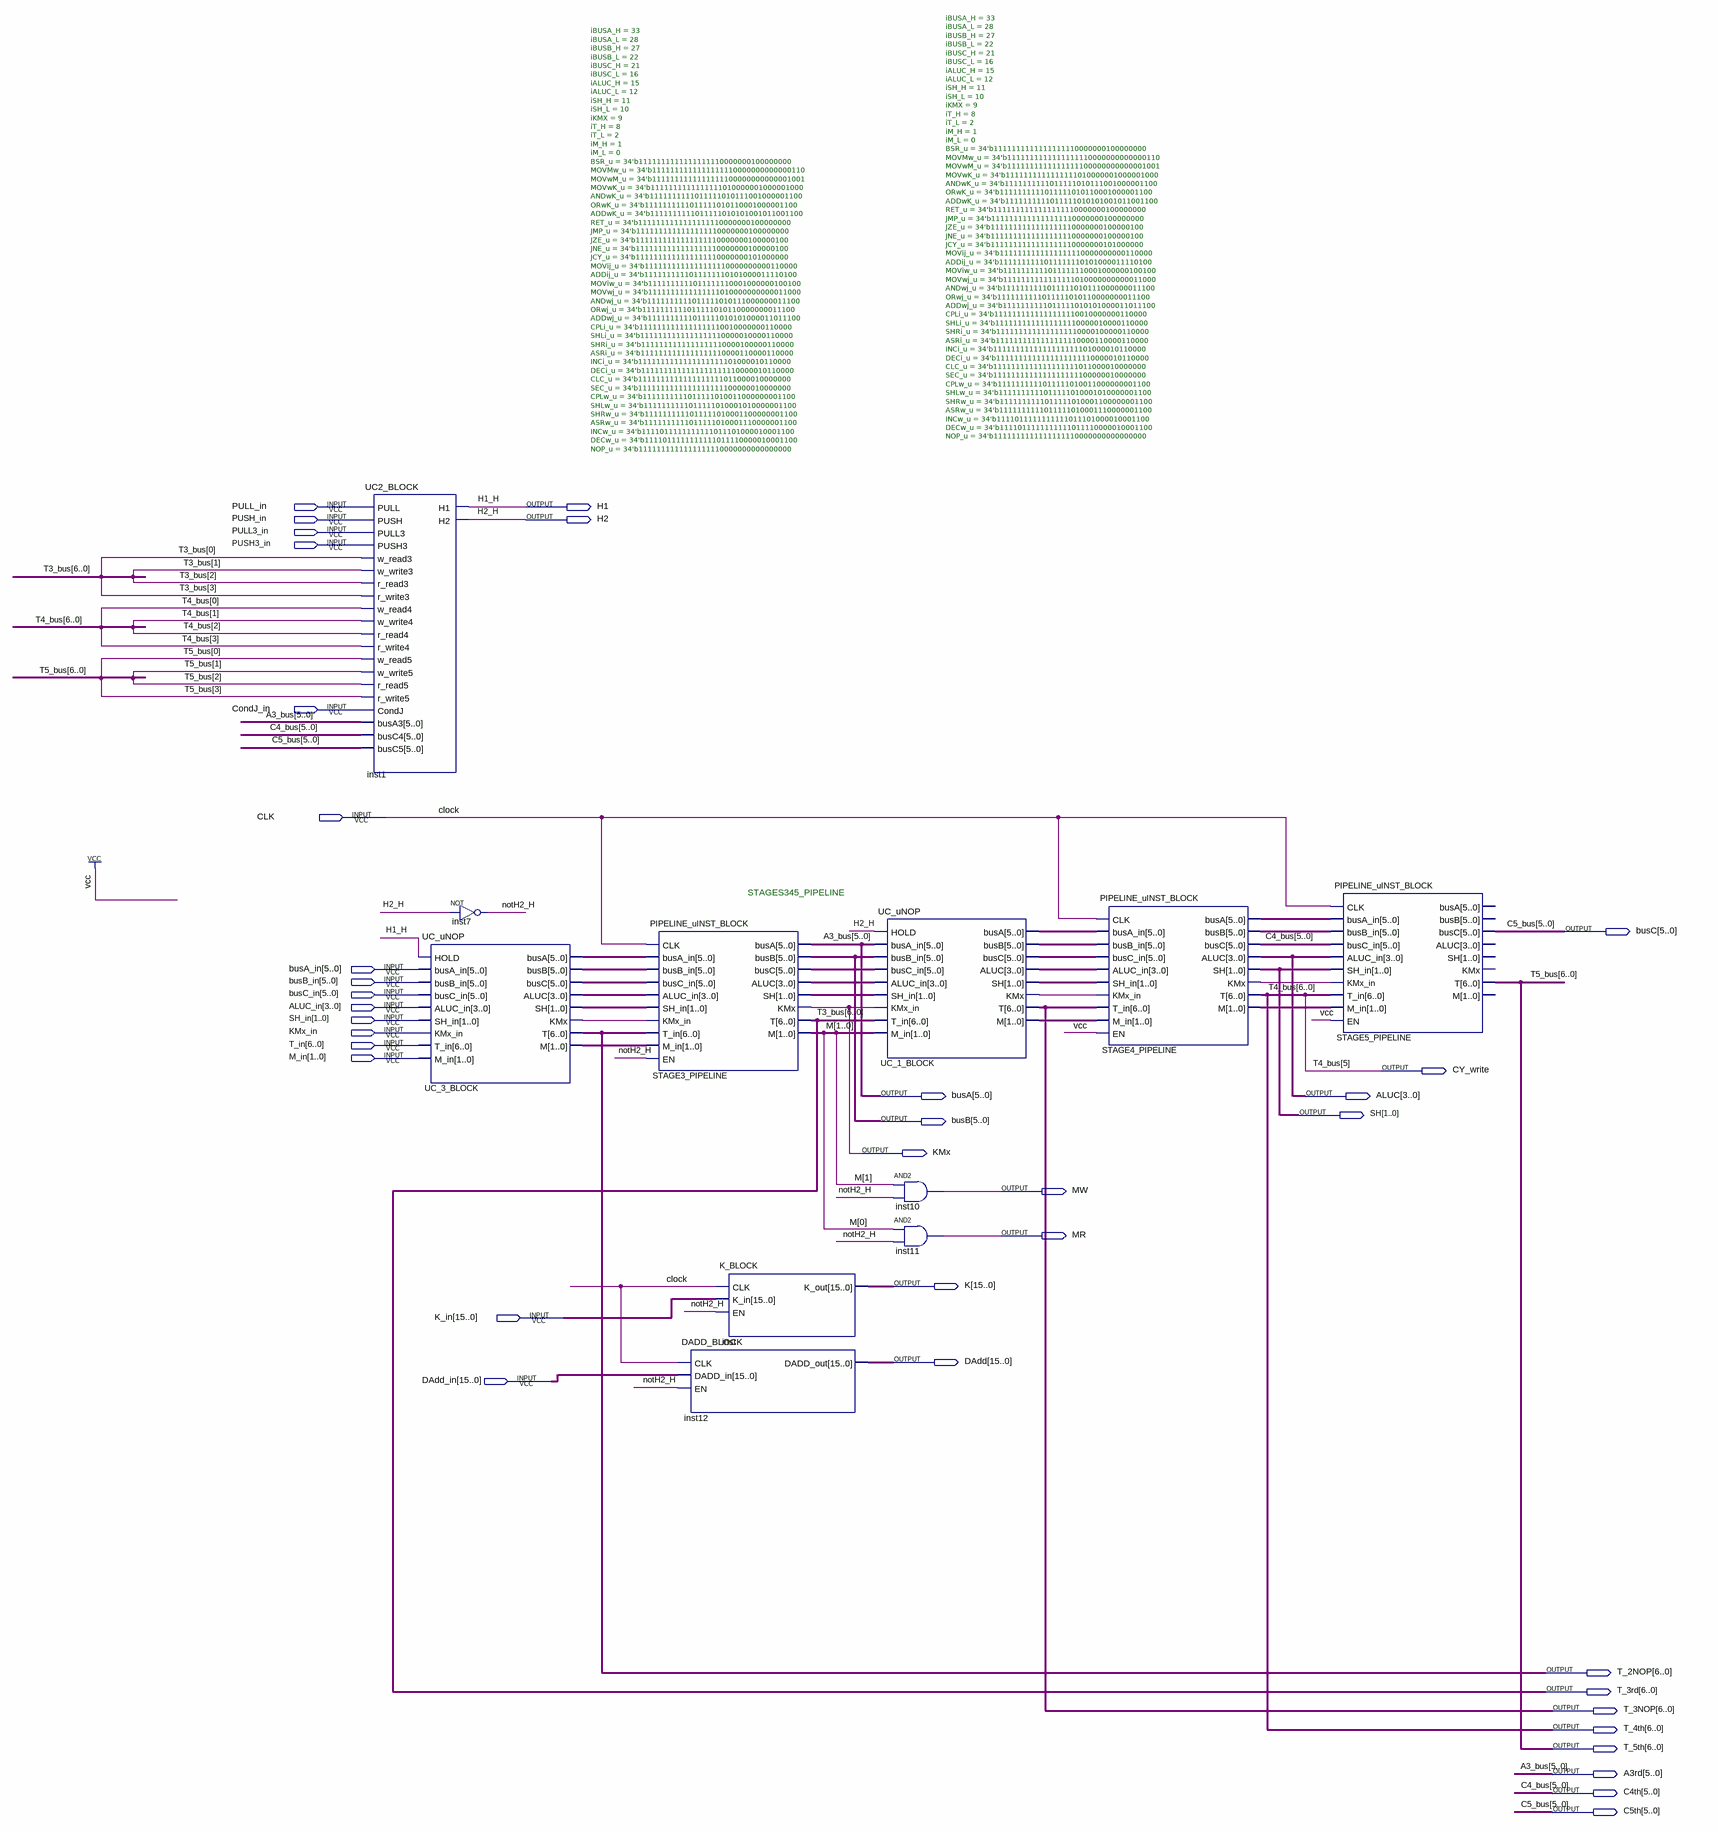
[diagram p0: schematic sheet]
// Quartus schematic STAGES345_PIPELINE.bdf as structural Verilog: 11 symbols, 37 pins
module STAGES345_PIPELINE (
  input  PULL_in,
  input  PUSH_in,
  input  PULL3_in,
  input  PUSH3_in,
  input  CondJ_in,
  input  CLK,
  input  [5:0] busA_in,
  input  [5:0] busB_in,
  input  [5:0] busC_in,
  input  [3:0] ALUC_in,
  input  [1:0] SH_in,
  input  KMx_in,
  input  [6:0] T_in,
  input  [1:0] M_in,
  input  [15:0] K_in,
  input  [15:0] DAdd_in,
  output H1,
  output H2,
  output [5:0] busC,
  output CY_write,
  output [5:0] busA,
  output [3:0] ALUC,
  output [1:0] SH,
  output [5:0] busB,
  output KMx,
  output MW,
  output MR,
  output [15:0] K,
  output [15:0] DAdd,
  output [6:0] T_2NOP,
  output [6:0] T_3rd,
  output [6:0] T_3NOP,
  output [6:0] T_4th,
  output [6:0] T_5th,
  output [5:0] A3rd,
  output [5:0] C4th,
  output [5:0] C5th
);

  wire notH2_H, STAGE4_PIPELINE_kmx, UC_1_BLOCK_kmx, UC_3_BLOCK_kmx;
  wire [1:0] M, STAGE3_PIPELINE_sh, STAGE4_PIPELINE_m, UC_1_BLOCK_m, UC_1_BLOCK_sh, UC_3_BLOCK_m,
       UC_3_BLOCK_sh;
  wire [3:0] STAGE3_PIPELINE_aluc, UC_1_BLOCK_aluc, UC_3_BLOCK_aluc;
  wire [5:0] STAGE3_PIPELINE_busc, STAGE4_PIPELINE_busa, STAGE4_PIPELINE_busb, UC_1_BLOCK_busa,
       UC_1_BLOCK_busb, UC_1_BLOCK_busc, UC_3_BLOCK_busa, UC_3_BLOCK_busb, UC_3_BLOCK_busc;

  UC2_BLOCK inst1 (
    .PULL(PULL_in), .w_read3(T_3rd[0]), .PUSH(PUSH_in), .w_write3(T_3rd[1]), .PULL3(PULL3_in),
    .w_read4(T_4th[0]), .PUSH3(PUSH3_in), .w_write4(T_4th[1]), .CondJ(CondJ_in), .w_read5(T_5th[0]),
    .w_write5(T_5th[1]), .r_read3(T_3rd[2]), .r_write3(T_3rd[3]), .r_read4(T_4th[2]), .r_write4(T_4th[3]),
    .r_read5(T_5th[2]), .r_write5(T_5th[3]), .busA3(A3rd), .busC4(C4th), .busC5(busC), .H1(H1), .H2(H2));
  UC_uNOP #(.iBUSA_H(33), .iBUSA_L(28), .iBUSB_H(27), .iBUSB_L(22), .iBUSC_H(21), .iBUSC_L(16), .iALUC_H(15), .iALUC_L(12), .iSH_H(11), .iSH_L(10), .iKMX(9), .iT_H(8), .iT_L(2), .iM_H(1), .iM_L(0), .BSR_u(34'b1111111111111111110000000100000000), .MOVMw_u(34'b1111111111111111110000000000000110), .MOVwM_u(34'b1111111111111111100000000000001001), .MOVwK_u(34'b1111111111111111010000001000001000), .ANDwK_u(34'b1111111111011111010111001000001100), .ORwK_u(34'b1111111111011111010110001000001100), .ADDwK_u(34'b1111111111011111010101001011001100), .RET_u(34'b1111111111111111110000000100000000), .JMP_u(34'b1111111111111111110000000100000000), .JZE_u(34'b1111111111111111110000000100000100), .JNE_u(34'b1111111111111111110000000100000100), .JCY_u(34'b1111111111111111110000000101000000), .MOVij_u(34'b1111111111111111110000000000110000), .ADDij_u(34'b1111111111011111110101000011110100), .MOViw_u(34'b1111111111011111110001000000100100), .MOVwj_u(34'b1111111111111111010000000000011000), .ANDwj_u(34'b1111111111011111010111000000011100), .ORwj_u(34'b1111111111011111010110000000011100), .ADDwj_u(34'b1111111111011111010101000011011100), .CPLi_u(34'b1111111111111111110010000000110000), .SHLi_u(34'b1111111111111111110000010000110000), .SHRi_u(34'b1111111111111111110000100000110000), .ASRi_u(34'b1111111111111111110000110000110000), .INCi_u(34'b1111111111111111111101000010110000), .DECi_u(34'b1111111111111111111110000010110000), .CLC_u(34'b1111111111111111111011000010000000), .SEC_u(34'b1111111111111111111100000010000000), .CPLw_u(34'b1111111111011111010011000000001100), .SHLw_u(34'b1111111111011111010001010000001100), .SHRw_u(34'b1111111111011111010001100000001100), .ASRw_u(34'b1111111111011111010001110000001100), .INCw_u(34'b1111011111111111011101000010001100), .DECw_u(34'b1111011111111111011110000010001100), .NOP_u(34'b1111111111111111110000000000000000)) UC_3_BLOCK (
    .HOLD(H1), .busA_in(busA_in), .busB_in(busB_in), .busC_in(busC_in), .ALUC_in(ALUC_in), .SH_in(SH_in),
    .KMx_in(KMx_in), .T_in(T_in), .M_in(M_in), .busA(UC_3_BLOCK_busa), .busB(UC_3_BLOCK_busb),
    .busC(UC_3_BLOCK_busc), .ALUC(UC_3_BLOCK_aluc), .SH(UC_3_BLOCK_sh), .KMx(UC_3_BLOCK_kmx), .T(T_2NOP),
    .M(UC_3_BLOCK_m));
  not inst7 (notH2_H, H2);
  PIPELINE_uINST_BLOCK STAGE3_PIPELINE (
    .CLK(CLK), .busA_in(UC_3_BLOCK_busa), .busB_in(UC_3_BLOCK_busb), .busC_in(UC_3_BLOCK_busc),
    .ALUC_in(UC_3_BLOCK_aluc), .SH_in(UC_3_BLOCK_sh), .KMx_in(UC_3_BLOCK_kmx), .T_in(T_2NOP),
    .M_in(UC_3_BLOCK_m), .EN(notH2_H), .busA(A3rd), .busB(busB), .busC(STAGE3_PIPELINE_busc),
    .ALUC(STAGE3_PIPELINE_aluc), .SH(STAGE3_PIPELINE_sh), .KMx(KMx), .T(T_3rd), .M(M));
  DADD_BLOCK inst12 (.CLK(CLK), .DADD_in(DAdd_in), .EN(notH2_H), .DADD_out(DAdd));
  K_BLOCK inst (.CLK(CLK), .K_in(K_in), .EN(notH2_H), .K_out(K));
  UC_uNOP #(.iBUSA_H(33), .iBUSA_L(28), .iBUSB_H(27), .iBUSB_L(22), .iBUSC_H(21), .iBUSC_L(16), .iALUC_H(15), .iALUC_L(12), .iSH_H(11), .iSH_L(10), .iKMX(9), .iT_H(8), .iT_L(2), .iM_H(1), .iM_L(0), .BSR_u(34'b1111111111111111110000000100000000), .MOVMw_u(34'b1111111111111111110000000000000110), .MOVwM_u(34'b1111111111111111100000000000001001), .MOVwK_u(34'b1111111111111111010000001000001000), .ANDwK_u(34'b1111111111011111010111001000001100), .ORwK_u(34'b1111111111011111010110001000001100), .ADDwK_u(34'b1111111111011111010101001011001100), .RET_u(34'b1111111111111111110000000100000000), .JMP_u(34'b1111111111111111110000000100000000), .JZE_u(34'b1111111111111111110000000100000100), .JNE_u(34'b1111111111111111110000000100000100), .JCY_u(34'b1111111111111111110000000101000000), .MOVij_u(34'b1111111111111111110000000000110000), .ADDij_u(34'b1111111111011111110101000011110100), .MOViw_u(34'b1111111111011111110001000000100100), .MOVwj_u(34'b1111111111111111010000000000011000), .ANDwj_u(34'b1111111111011111010111000000011100), .ORwj_u(34'b1111111111011111010110000000011100), .ADDwj_u(34'b1111111111011111010101000011011100), .CPLi_u(34'b1111111111111111110010000000110000), .SHLi_u(34'b1111111111111111110000010000110000), .SHRi_u(34'b1111111111111111110000100000110000), .ASRi_u(34'b1111111111111111110000110000110000), .INCi_u(34'b1111111111111111111101000010110000), .DECi_u(34'b1111111111111111111110000010110000), .CLC_u(34'b1111111111111111111011000010000000), .SEC_u(34'b1111111111111111111100000010000000), .CPLw_u(34'b1111111111011111010011000000001100), .SHLw_u(34'b1111111111011111010001010000001100), .SHRw_u(34'b1111111111011111010001100000001100), .ASRw_u(34'b1111111111011111010001110000001100), .INCw_u(34'b1111011111111111011101000010001100), .DECw_u(34'b1111011111111111011110000010001100), .NOP_u(34'b1111111111111111110000000000000000)) UC_1_BLOCK (
    .HOLD(H2), .busA_in(A3rd), .busB_in(busB), .busC_in(STAGE3_PIPELINE_busc),
    .ALUC_in(STAGE3_PIPELINE_aluc), .SH_in(STAGE3_PIPELINE_sh), .KMx_in(KMx), .T_in(T_3rd), .M_in(M),
    .busA(UC_1_BLOCK_busa), .busB(UC_1_BLOCK_busb), .busC(UC_1_BLOCK_busc), .ALUC(UC_1_BLOCK_aluc),
    .SH(UC_1_BLOCK_sh), .KMx(UC_1_BLOCK_kmx), .T(T_3NOP), .M(UC_1_BLOCK_m));
  and inst10 (MW, M[1], notH2_H);
  and inst11 (MR, M[0], notH2_H);
  PIPELINE_uINST_BLOCK STAGE4_PIPELINE (
    .CLK(CLK), .busA_in(UC_1_BLOCK_busa), .busB_in(UC_1_BLOCK_busb), .busC_in(UC_1_BLOCK_busc),
    .ALUC_in(UC_1_BLOCK_aluc), .SH_in(UC_1_BLOCK_sh), .KMx_in(UC_1_BLOCK_kmx), .T_in(T_3NOP),
    .M_in(UC_1_BLOCK_m), .EN(1'b1), .busA(STAGE4_PIPELINE_busa), .busB(STAGE4_PIPELINE_busb), .busC(C4th),
    .ALUC(ALUC), .SH(SH), .KMx(STAGE4_PIPELINE_kmx), .T({T_4th[6], CY_write, T_4th[4:0]}),
    .M(STAGE4_PIPELINE_m));
  PIPELINE_uINST_BLOCK STAGE5_PIPELINE (
    .CLK(CLK), .busA_in(STAGE4_PIPELINE_busa), .busB_in(STAGE4_PIPELINE_busb), .busC_in(C4th),
    .ALUC_in(ALUC), .SH_in(SH), .KMx_in(STAGE4_PIPELINE_kmx), .T_in({T_4th[6], CY_write, T_4th[4:0]}),
    .M_in(STAGE4_PIPELINE_m), .EN(1'b1), .busC(busC), .T(T_5th));  // open: busA, busB, ALUC, SH, KMx, M

  assign busA = A3rd;
  assign C5th = busC;
  assign T_4th[5] = CY_write;

  // Other names for the same wires on the sheet: A3_bus[5:0] = A3rd; C4_bus[5:0] = C4th; C5_bus[5:0] = busC;
  //   clock = CLK; H1_H = H1; H2_H = H2; T3_bus[6:0] = T_3rd; T4_bus[6:0] = {T_4th[6], CY_write, T_4th[4:0]};
  //   T5_bus[6:0] = T_5th

  // Notes on the sheet:
  //   STAGES345_PIPELINE
endmodule
